# EAGLE design v1 (EAGLE 6.3)

## Sheet 1 of 2
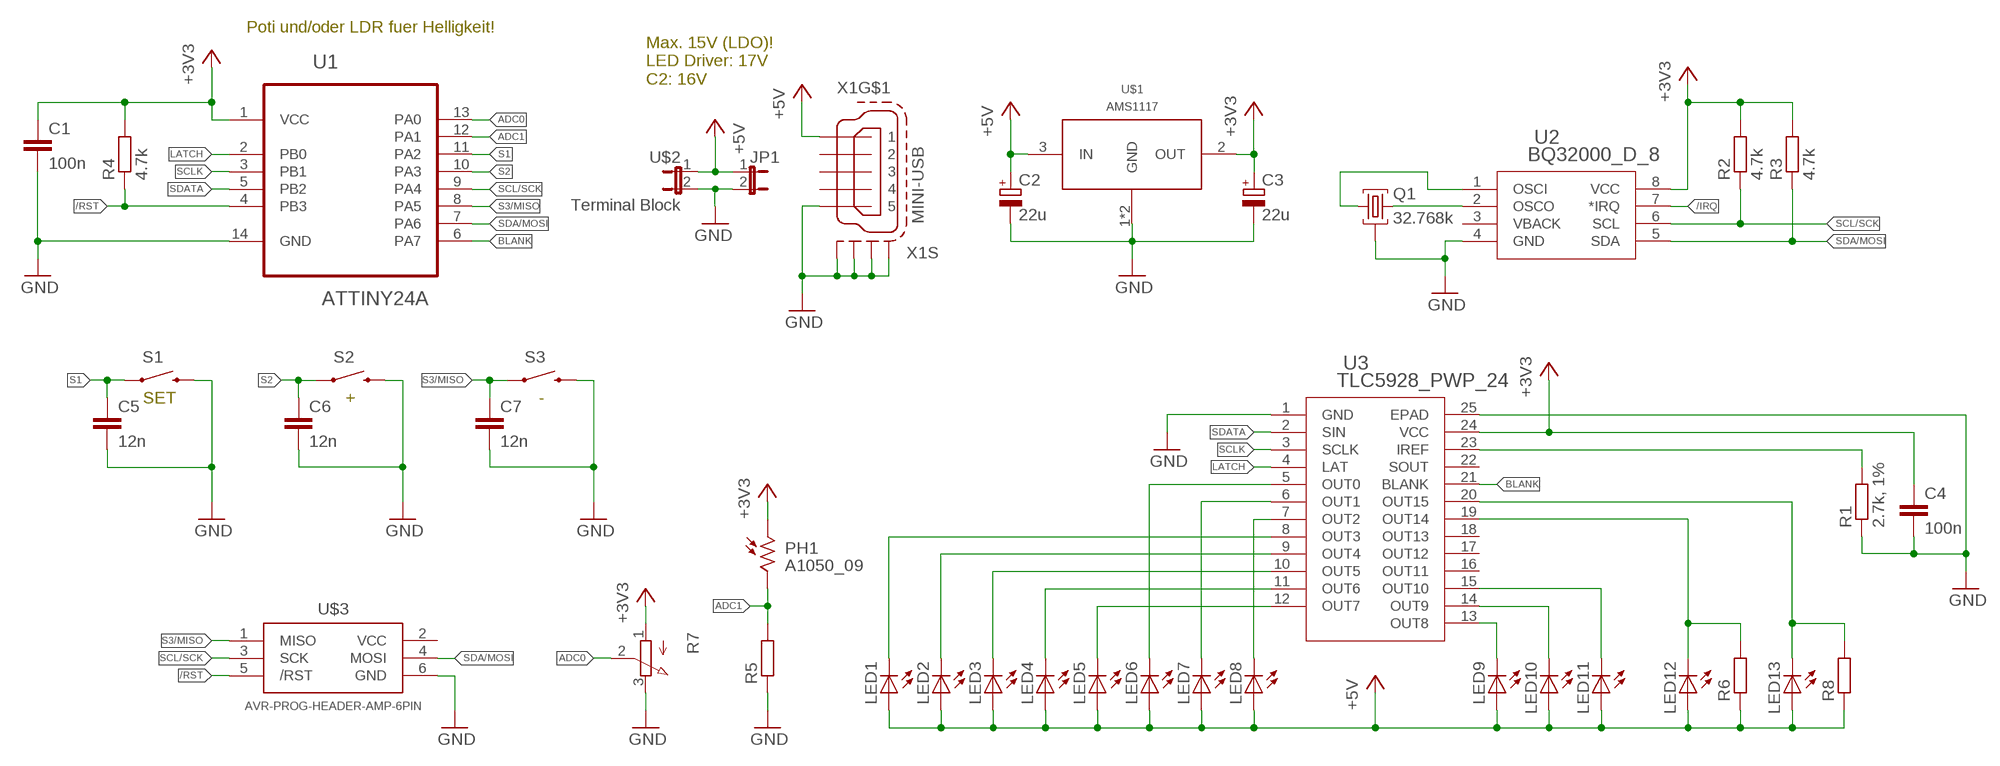
[diagram p0: schematic, sheet 1]

### Parts
C1  100n  C-EUC0603  [C0603]
C2  22u  CPOL-EU153CLV-0505  [153CLV-0505]
C3  22u  CPOL-EU153CLV-0505  [153CLV-0505]
C4  100n  C-EUC0603  [C0603]
C5  12n  C-EUC0603  [C0603]
C6  12n  C-EUC0603  [C0603]
C7  12n  C-EUC0603  [C0603]
JP1  JP1E  [JP1]
LED1  LEDCHIP-LED0603  [CHIP-LED0603]
LED2  LEDCHIP-LED0603  [CHIP-LED0603]
LED3  LEDCHIP-LED0603  [CHIP-LED0603]
LED4  LEDCHIP-LED0603  [CHIP-LED0603]
LED5  LEDCHIP-LED0603  [CHIP-LED0603]
LED6  LEDCHIP-LED0603  [CHIP-LED0603]
LED7  LEDCHIP-LED0603  [CHIP-LED0603]
LED8  LEDCHIP-LED0603  [CHIP-LED0603]
LED9  LEDCHIP-LED0603  [CHIP-LED0603]
LED10  LEDCHIP-LED0603  [CHIP-LED0603]
LED11  LEDCHIP-LED0603  [CHIP-LED0603]
LED12  LEDCHIP-LED0603  [CHIP-LED0603]
LED13  LEDCHIP-LED0603  [CHIP-LED0603]
PH1  A1050_09  [T0-46-A10XX]
Q1  32.768k  CRYSTAL_TC38_SHIELD  [TC38]
R1  2.7k, 1%  R-EU_R1206  [R1206]
R2  4.7k  R-EU_R0603  [R0603]
R3  4.7k  R-EU_R0603  [R0603]
R4  4.7k  R-EU_R0603  [R0603]
R5  R-EU_R0603  [R0603]
R6  R-EU_R0603  [R0603]
R7  3RP/1610N  [3RP/1610N]
R8  R-EU_R0603  [R0603]
S1  SWITCH-MOMENTARY-2PTH  [TACTILE-PTH]
S2  SWITCH-MOMENTARY-2PTH  [TACTILE-PTH]
S3  SWITCH-MOMENTARY-2PTH  [TACTILE-PTH]
U1  ATTINY24A  ATTINY24A-SSU  [SOIC127P600X175-14N]
U2  BQ32000_D_8  [D8]
U3  TLC5928_PWP_24  [PWP24_4P87X2P4]
U$1  AMS1117  [DCY4]
U$2  Terminal Block  BASTLI_SCREW_TERMINAL_SMALL  [BASTLI_SCREW_TERMINAL_SMALL]
U$3  AVR-PROG-HEADER-AMP-6PIN  [AMP-TMM-1-0-06]
X1  MINI-USB  MINI-USB-SCHIELD-32005-201  [32005-201]

### Nets
+3V3: C1.1 C3.+ C4.1 PH1.1 R2.2 R3.2 R4.2 R7.1(A) U1.1(VCC) U2.8(VCC) U3.24(VCC) U$1.2(OUT)
+5V: C2.+ JP1.1 LED1.A LED2.A LED3.A LED4.A LED5.A LED6.A LED7.A LED8.A LED9.A LED10.A LED11.A LED12.A LED13.A R6.1 R8.1 U$1.3(IN) U$2.1 X1.1
/IRQ: U2.7(*IRQ)
/RST: R4.1 U1.4(PB3) U$3.5(/RST)
ADC0: R7.2(S) U1.13(PA0)
ADC1: PH1.2 R5.2 U1.12(PA1)
BLANK: U1.6(PA7) U3.21(BLANK)
GND: C1.2 C2.- C3.- C4.2 C5.2 C6.2 C7.2 JP1.2 Q1.1 R1.1 R5.1 R7.3(E) S1.3 S2.3 S3.3 U1.14(GND) U2.4(GND) U3.1(GND) U3.25(EPAD) U$1.1(GND) U$1.4(GND) U$2.2 U$3.6(GND) X1.5 X1.M1(S:S1) X1.M2(S:S2) X1.M3(S:S3) X1.M4(S:S4) ; also sheet 2
LATCH: U1.2(PB0) U3.4(LAT)
N$1: LED1.C U3.8(OUT3)
N$2: LED2.C U3.9(OUT4)
N$3: LED3.C U3.10(OUT5)
N$4: LED4.C U3.11(OUT6)
N$5: LED5.C U3.12(OUT7)
N$6: R1.2 U3.23(IREF)
N$7: LED6.C U3.5(OUT0)
N$8: LED7.C U3.6(OUT1)
N$9: LED8.C U3.7(OUT2)
N$10: LED9.C U3.13(OUT8)
N$11: LED10.C U3.14(OUT9)
N$12: LED11.C U3.15(OUT10)
N$16: LED12.C R6.2 U3.19(OUT14)
N$17: LED13.C R8.2 U3.20(OUT15)
N$18: Q1.3 U2.2(OSCO)
N$19: Q1.2 U2.1(OSCI)
S1: C5.1 S1.1 U1.11(PA2)
S2: C6.1 S2.1 U1.10(PA3)
S3/MISO: C7.1 S3.1 U1.8(PA5) U$3.1(MISO)
SCL/SCK: R2.1 U1.9(PA4) U2.6(SCL) U$3.3(SCK)
SCLK: U1.3(PB1) U3.3(SCLK)
SDA/MOSI: R3.1 U1.7(PA6) U2.5(SDA) U$3.4(MOSI)
SDATA: U1.5(PB2) U3.2(SIN)
Unconnected: U3.16(OUT11) U3.17(OUT12) U3.18(OUT13) U3.22(SOUT) U$3.2(VCC) X1.2 X1.3 X1.4

### Notes on the sheet
- Poti und/oder LDR fuer Helligkeit!
- Max. 15V (LDO)!
  LED Driver: 17V
  C2: 16V
- SET | + | -

## Sheet 2 of 2
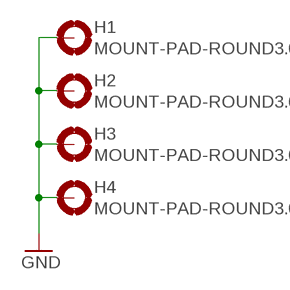
[diagram p1: schematic, sheet 2]

### Parts
H1  MOUNT-PAD-ROUND3.0  [3,0-PAD]
H2  MOUNT-PAD-ROUND3.0  [3,0-PAD]
H3  MOUNT-PAD-ROUND3.0  [3,0-PAD]
H4  MOUNT-PAD-ROUND3.0  [3,0-PAD]

### Nets
GND: H1.B3,0(MOUNT) H2.B3,0(MOUNT) H3.B3,0(MOUNT) H4.B3,0(MOUNT) ; also sheet 1

## Power pins joined to a net without a drawn wire
VBACK: U2.3(VBACK)

## Library data of the parts
C1 C4-C7 = rcl:C-EU: CAPACITOR, European symbol
C2 C3 = rcl:CPOL-EU: POLARIZED CAPACITOR, European symbol
H1-H4 = holes:MOUNT-PAD-ROUND: MOUNTING PAD, round
JP1 = jumper:JP1E: JUMPER
LED1-LED13 = led:LED: LED OSRAM: - CHIPLED LG R971, LG N971, LY N971, LG Q971, LY Q971, LO R971, LY R971 LH N974, LH R974 LS Q976, LO Q976, LY Q976 LO Q996 - Hyper CHIPLED LW Q18S LB Q993, LB Q99A, LB R99A - SideLED LS A670, LO A670, LY A670, LG A670, LP A670 LB A673, LV A673, LT A673, LW A673 LH A674 LY A675 LS A676, LA A676, LO A676, LY A676, LW A676 LS A679, LY A679, LG A679 - Hyper Micro SIDELED® LS Y876, LA Y876, LO Y876, LY Y876 LT Y87S - SmartLED LW L88C, LW L88S LB L89C, LB L89S, LG L890 LS L89K, LO L89K, LY L89K LS L896, LA L896, LO L896, LY L896 - TOPLED LS T670, LO T670, LY T670, LG T670, LP T670 LSG T670, LSP T670, LSY T670, LOP T670, LYG T670 LG T671, LOG T671, LSG T671 LB T673, LV T673, LT T673, LW T673 LH T674 LS T676, LA T676, LO T676, LY T676, LB T676, LH T676, LSB T676, LW T676 LB T67C, LV T67C, LT T67C, LS T67K, LO T67K, LY T67K, LW E67C LS E67B, LA E67B, LO E67B, LY E67B, LB E67C, LV E67C, LT E67C LW T67C LS T679, LY T679, LG T679 LS T770, LO T770, LY T770, LG T770, LP T770 LB T773, LV T773, LT T773, LW T773 LH T774 LS E675, LA E675, LY E675, LS T675 LS T776, LA T776, LO T776, LY T776, LB T776 LHGB T686 LT T68C, LB T68C - Hyper Mini TOPLED® LB M676 - Mini TOPLED Santana® LG M470 LS M47K, LO M47K, LY M47K Source: http://www.osram.convergy.de LUXEON: - LUMILED® LXK2-PW12-R00, LXK2-PW12-S00, LXK2-PW14-U00, LXK2-PW14-V00 LXK2-PM12-R00, LXK2-PM12-S00, LXK2-PM14-U00 LXK2-PE12-Q00, LXK2-PE12-R00, LXK2-PE12-S00, LXK2-PE14-T00, LXK2-PE14-U00 LXK2-PB12-K00, LXK2-PB12-L00, LXK2-PB12-M00, LXK2-PB14-N00, LXK2-PB14-P00, LXK2-PB14-Q00 LXK2-PR12-L00, LXK2-PR12-M00, LXK2-PR14-Q00, LXK2-PR14-R00 LXK2-PD12-Q00, LXK2-PD12-R00, LXK2-PD12-S00 LXK2-PH12-R00, LXK2-PH12-S00 LXK2-PL12-P00, LXK2-PL12-Q00, LXK2-PL12-R00 Source: www.luxeon.com KINGBRIGHT: KA-3528ASYC Source: www.kingbright.com
PH1 = photo-elements:A10: Sensor Robust Light Sensing Applications Outdoor Light Sensing Application Source: http://optoelectronics.perkinelmer.com/content/Datasheets/DTS_PhotocellsA1050.pdf
Q1 = Parts:CRYSTAL_TC38_SHIELD
R1-R6 R8 = rcl:R-EU_: RESISTOR, European symbol
R7 = pot:3RP/1610N: 16mm Potentiometer one level Source: http://www.alphapotentiometers.net/html/16mm_pot_2.html
S1-S3 = SparkFun-Electromechanical:SWITCH-MOMENTARY-2: Various NO switches- pushbuttons, reed, etc
U1 = Farnell:ATTINY24A-SSU: 8-bit Microcontroller with In-System Programmable Flash; MPN: ATTINY24A-SSU; OC_FARNELL: 1699395; OC_NEWARK: 80P3681; PACKAGE: SOIC-14; SUPPLIER: Atmel
U2 = Parts:BQ32000_D_8; DATASHEETURL: http://www.ti.com/lit/gpn/BQ32000; DESCRIPTION: Serial RTC with Battery Backup and Trickle Charge; FAMILY_NAME: REAL-TIME CLOCK; GENERIC_PART_NUMBER: BQ32000; INDUSTRY_STD_PKG_TYPE: SOIC; MANUFACTURER: Texas Instruments; PACKAGE_DESIGNATOR: D; PIN_COUNT: 8
U3 = Parts:TLC5928_PWP_24; DATASHEETURL: http://www.ti.com/lit/gpn/TLC5928; DESCRIPTION: 16 Channel Constant Current LED Driver with LED Open Detection; FAMILY_NAME: LED DRIVER; GENERIC_PART_NUMBER: TLC5928; INDUSTRY_STD_PKG_TYPE: HTSSOP; MANUFACTURER: Texas Instruments; MANUFACTURER_PART_NUMBER: tlc5928_pwp_24; PACKAGE_DESIGNATOR: PWP; PIN_COUNT: 24; VENDOR: Texas Instruments
U$1 = Parts:AMS1117: AMS1117 1A low dropout voltage regulator 1V max dropout SOT-223
U$2 = Parts:BASTLI_SCREW_TERMINAL_SMALL
U$3 = Parts:AVR-PROG-HEADER-AMP-6PIN
X1 = con-cypressindustries:MINI-USB-SCHIELD-: MINI USB-B Conector Source: www.cypressindustries.com; OC_FARNELL: unknown; OC_NEWARK: unknown

## Board
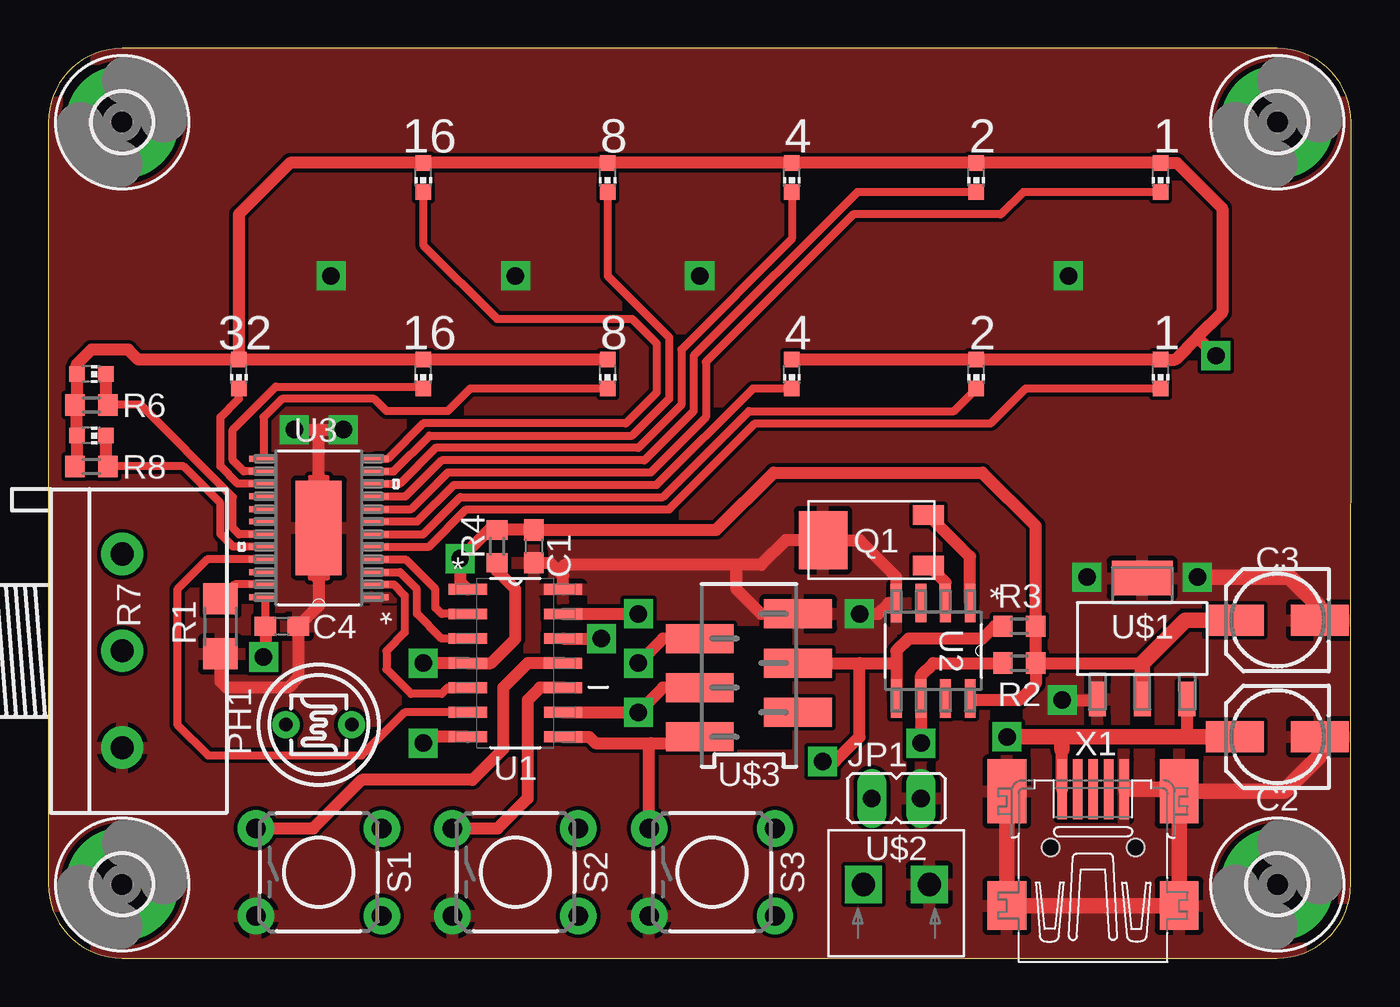
[diagram p2: board, top side]
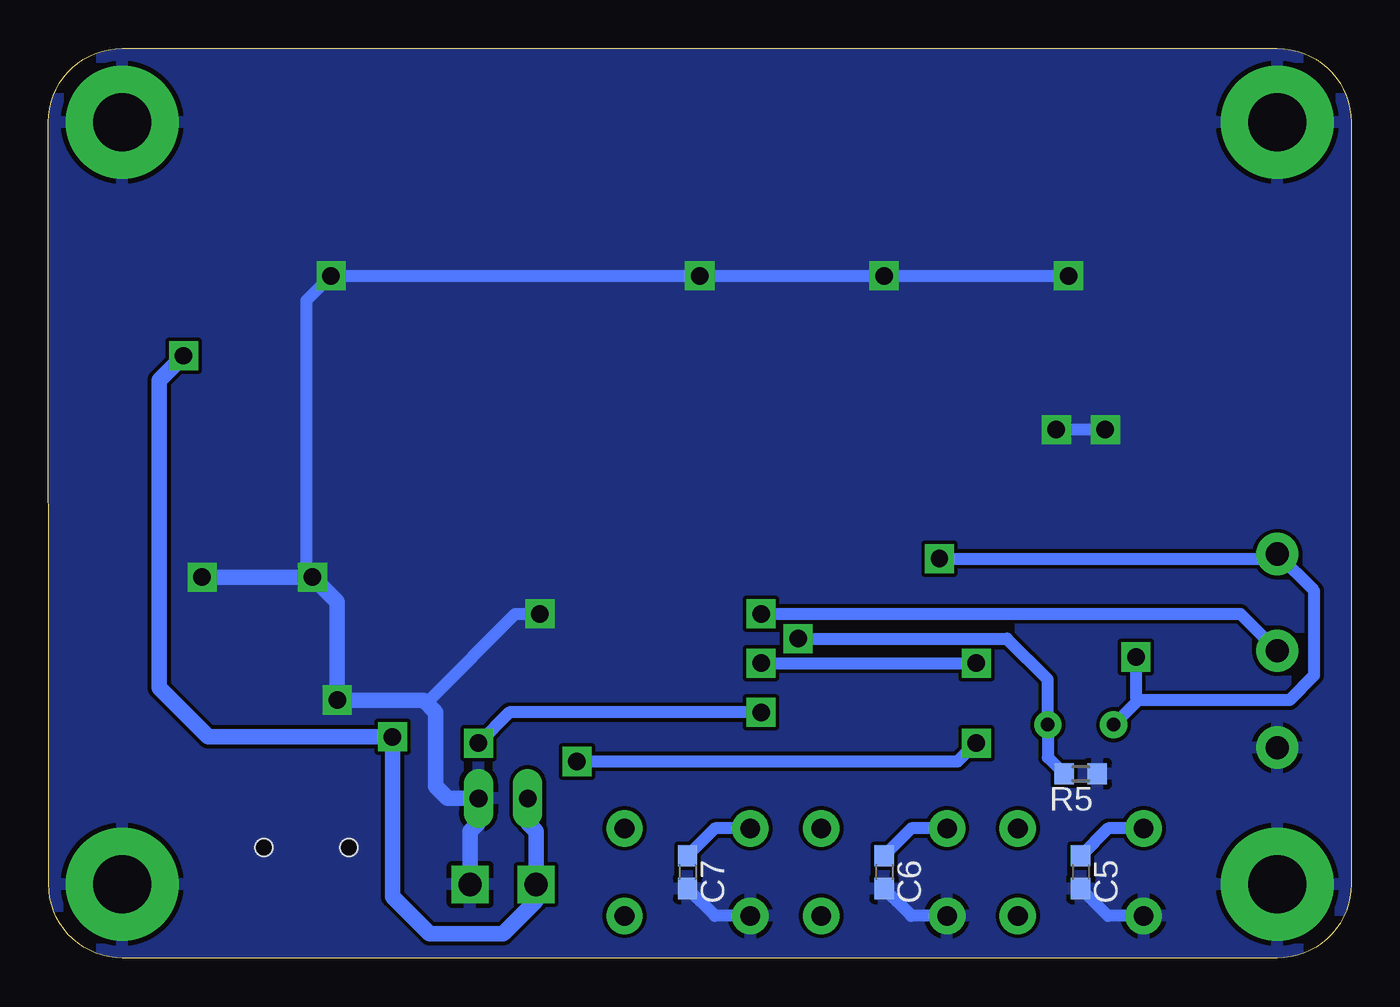
[diagram p3: board, bottom side, seen from below]

Size 67.31 x 46.99 mm. Coordinates in mm from the lower left corner, seen from the top.
Outline: 0,43.18 0,3.81 arc90 3.81,0 63.48,0 arc90 67.29,3.81 67.31,43.18 arc90 63.5,46.99 3.81,46.99 arc90 0,43.18
Copper layers (1*16): Top 0.035mm / dielectric 1.5mm / Bottom 0.035mm
Design rules "bastli-pcb *": minimum track width 0.2mm, minimum drill 0.4mm, track to track 0.2mm, track to pad 0.2mm, pad to pad 0.2mm, via to via 0.2mm, smd to smd 0.2mm, copper to edge 1mil, drill to drill 8mil, minimum pad ring 0.3mm, minimum via ring 0.3mm, stop-mask expansion 4mil, vias tented up to drill 0mil, thermal gap 10mil
tRestrict: area 34,10.8 to 38.4,17.1

### Footprints (pad centres in the part's own frame; a part is rotated, then mirrored left to right if it is on the bottom)
C0603 = smd 1.1 x 1: 1 -0.85,0; 2 0.85,0
153CLV-0505 = smd 3 x 1.6: + 2.2,0; - -2.2,0
3,0-PAD = drill 3 pad 5.842: B3,0 0,0
JP1 = drill 0.914 long: 1 0,-1.27; 2 0,1.27
CHIP-LED0603 = smd 0.8 x 0.8: A 0,-0.75; C 0,0.75
T0-46-A10XX = drill 0.7 pad 1.4: 1 -1.7,0; 2 1.7,0
TC38 = smd 2.5 x 3: 1 -1.25,0 | smd 1.6 x 1: 2 4.2,1.3; 3 4.2,-1.3
R1206 = smd 1.6 x 1.803: 1 -1.422,0; 2 1.422,0
R0603 = smd 1 x 1.1: 1 -0.85,0; 2 0.85,0
3RP/1610N = drill 1.2 pad 2.184: 1 -5,0; 2 0,0; 3 5,0
TACTILE-PTH = drill 1.016 pad 1.88: 1 -3.251,2.261; 2 3.251,2.261; 3 -3.251,-2.261; 4 3.251,-2.261
SOIC127P600X175-14N = smd 1.981 x 0.559: 1 -2.464,3.81; 2 -2.464,2.54; 3 -2.464,1.27; 4 -2.464,0; 5 -2.464,-1.27; 6 -2.464,-2.54; 7 -2.464,-3.81; 8 2.464,-3.81; 9 2.464,-2.54; 10 2.464,-1.27; 11 2.464,0; 12 2.464,1.27; 13 2.464,2.54; 14 2.464,3.81
D8 = smd 1.981 x 0.559: 1 -2.464,1.905; 2 -2.464,0.635; 3 -2.464,-0.635; 4 -2.464,-1.905; 5 2.464,-1.905; 6 2.464,-0.635; 7 2.464,0.635; 8 2.464,1.905
PWP24_4P87X2P4 = smd 1.27 x 0.305: 1 -2.972,3.581; 2 -2.972,2.921; 3 -2.972,2.286; 4 -2.972,1.626; 5 -2.972,0.965; 6 -2.972,0.33; 7 -2.972,-0.33; 8 -2.972,-0.965; 9 -2.972,-1.626; 10 -2.972,-2.286; 11 -2.972,-2.921; 12 -2.972,-3.581; 13 2.972,-3.581; 14 2.972,-2.921; 15 2.972,-2.286; 16 2.972,-1.626; 17 2.972,-0.965; 18 2.972,-0.33; 19 2.972,0.33; 20 2.972,0.965; 21 2.972,1.626; 22 2.972,2.286; 23 2.972,2.921; 24 2.972,3.581 | smd 2.388 x 4.877: 25 0,0
DCY4 = smd 0.889 x 1.778: 1 -2.311,-3.124; 2 0,-3.124; 3 2.311,-3.124 | smd 3.15 x 1.778: 4 0,3.124
BASTLI_SCREW_TERMINAL_SMALL = drill 1.2 square: 1 -1.7,0; 2 1.7,0
AMP-TMM-1-0-06 = smd 1.5 x 3.5: 1 3.175,-2.54; 2 1.905,2.54; 3 0.635,-2.54; 4 -0.635,2.54; 5 -1.905,-2.54; 6 -3.175,2.54
32005-201 = smd 3.1 x 0.5: 1 3,1.6; 2 3,0.8; 3 3,0; 4 3,-0.8; 5 3,-1.6 | smd 2.5 x 2: M1 -3,-4.45; M2 -3,4.45 | smd 3.3 x 2: M3 2.9,4.45; M4 2.9,-4.45 | hole 0.9: 0,2.2; 0,-2.2

### Placement (x,y rotation side)
C1  25.08,21.27 270 top
C2  63.5,11.43 180 top
C3  63.5,17.46 180 top
C4  12.06,17.14 0 top
C5  13.97,4.45 270 bottom
C6  24.13,4.45 270 bottom
C7  34.29,4.45 270 bottom
H1  63.5,43.18 0 top
H2  3.81,43.18 0 top
H3  3.81,3.81 0 top
H4  63.5,3.81 0 top
JP1  43.81,8.26 270 top
LED1  57.47,40.32 180 top
LED2  47.94,40.32 180 top
LED3  38.42,40.32 180 top
LED4  28.89,40.32 180 top
LED5  19.37,40.32 180 top
LED6  57.47,30.16 180 top
LED7  47.94,30.16 180 top
LED8  38.42,30.16 180 top
LED9  28.89,30.16 180 top
LED10  19.37,30.16 180 top
LED11  9.84,30.16 180 top
LED12  2.22,30.16 270 top
LED13  2.22,26.99 270 top
PH1  13.97,12.06 0 top
Q1  41.27,21.59 0 top
R1  8.89,17.14 90 top
R2  50.16,15.24 0 top
R3  50.16,17.14 0 top
R4  23.18,21.27 90 top
R5  13.97,9.53 180 bottom
R6  2.22,28.57 0 top
R7  3.81,15.88 270 top
R8  2.22,25.4 0 top
S1  13.97,4.45 0 top
S2  24.13,4.45 0 top
S3  34.29,4.45 0 top
U1  24.13,15.24 0 top
U2  45.72,15.88 270 top
U3  13.97,22.23 180 top
U$1  56.52,16.51 0 top
U$2  43.81,3.81 0 top
U$3  36.2,14.61 270 top
X1  53.98,5.71 90 top

### Tracks (layer width: path | path; a pad name or v marks a point on that pad's centre or on a via)
+3V3  (via drill 0.9)
  Top 0.406: C4.1 11.21,18.43 U3.24
  Top 0.61: R2.2 51.02,14.19 50.16,13.34 47.7,13.34 U2.8 | R2.2 R3.2 51.02,22.33 48.26,25.08 37.47,25.08 34.51,22.12 C1.1 R4.2 22.76,22.12 v21.27,20.64 21.27,19.44 U1.1 | R2.2 56.52,15.24 | C4.1 11.21,15.66 v11.11,15.56
  Top 0.813: U$1.2 56.52,15.24 58.74,17.46 C3.+
  Bottom 0.61: 11,13.34 3.17,13.34 1.91,14.61 1.91,18.97 R7.1 4.05,20.64 v21.27,20.64 | 11,13.34 PH1.1 | v11.11,15.56 11.11,13.45 11,13.34
+5V  (via drill 0.9)
  Top 0.61: X1.1 52.38,10.78 | U$1.3 58.83,11.66 59.05,11.43 | LED8.A LED7.A LED6.A 58.22,30.91 59.37,32.07 | LED9.A LED10.A LED11.A | LED11.A 9.84,38.42 12.5,41.07 LED5.A LED4.A LED3.A LED2.A LED1.A 58.3,41.07 60.64,38.73 60.64,33.34 59.37,32.07 | 59.37,32.07 v60.33,31.11 | R8.1 1.47,25.5 LED13.A 1.47,28.48 R6.1 1.47,28.68 LED12.A 1.47,30.68 2.22,31.43 4.13,31.43 4.65,30.91 LED11.A
  Top 0.813: 52.38,10.78 52.38,11.43 | 52.38,11.43 59.05,11.43 C2.+ | 52.38,11.43 v49.53,11.43
  Bottom 0.813: JP1.1 42.55,6.99 42.12,6.55 U$2.1 42.12,2.97 43.81,1.27 47.62,1.27 49.53,3.17 v49.53,11.43 59.05,11.43 61.59,13.97 61.59,29.84 v60.33,31.11
/RST  (via drill 0.9)
  Top 0.61: U$3.5 31.75,16.51 v30.48,15.24 | v19.37,15.24 U1.4 22.86,15.24 24.13,16.51 24.13,19.05 23.18,20 R4.1
  Bottom 0.61: v30.48,15.24 v19.37,15.24
ADC0  (via drill 0.9)
  Top 0.61: U1.13 v30.48,17.78
  Bottom 0.61: v30.48,17.78 5.71,17.78 R7.2
ADC1  (via drill 0.9)
  Top 0.61: U1.12 v28.57,16.51
  Bottom 0.61: v28.57,16.51 17.78,16.51 15.67,14.4 PH1.2 15.67,10.38 R5.2
BLANK
  Top 0.406: U3.21 8.22,20.6 6.67,19.05 6.67,12.06 8.26,10.48 16.19,10.48 18.41,12.7 U1.6
GND  (via drill 0.9)
  Top 0.61: 35.56,20.32 36.83,20.32 38.1,21.59 Q1.1 41.91,21.59 43.81,19.68 U2.4 43.42,18.34 42.86,17.78 v41.91,17.78 | 35.56,20.32 26.67,20.32 26.35,20 | U$3.6 36.83,17.78 35.56,19.05 35.56,20.32 | X1.5 55.7,8.71 | v12.7,27.3 13.97,27.3 | 13.97,27.3 v15.24,27.3 | 13.97,24.77 13.97,27.3 | v52.39,13.34 54.15,13.34 U$1.1 | U1.14 26.59,19.76 26.35,20 | C1.2 25.93,20.42 26.35,20 | 13.97,19.68 13.97,18.2 C4.2 12.91,14.5 12.38,13.97 9.21,13.97 8.89,14.29 R1.1
  Top 0.813: v59.37,19.68 64.14,19.68 65.7,18.12 C3.- | 55.7,8.71 58.33,8.71 X1.M4 | X1.M4 63.86,8.62 65.7,10.46 C2.- | X1.M3 X1.M2 X1.M1 X1.M4 | 13.97,24.77 U3.25 13.97,19.68
  Bottom 0.61: S1.3 12.56,2.18 C5.2 | S2.3 22.72,2.18 C6.2 | S3.3 32.88,2.18 C7.2 | v12.7,27.3 v15.24,27.3 | 47.62,13.02 47.62,13.34 43.18,17.78 v41.91,17.78 | v14.61,35.24 v24.13,35.24 v33.66,35.24 v52.7,35.24 53.98,33.97 53.98,19.68
  Bottom 0.813: U$2.2 45.52,6.55 45.09,6.99 JP1.2 46.67,8.26 47.31,8.89 47.31,12.7 47.62,13.02 47.94,13.34 v52.39,13.34 52.39,18.41 v53.66,19.68 53.98,19.68 v59.37,19.68
  pour Top: 0,46.99 67.31,46.99 67.31,0 0,0
  pour Bottom: 0,46.99 67.31,46.99 67.31,0 0,0
LATCH
  Top 0.406: U3.4 18.45,20.6 20,19.05 20,18.1 20.32,17.78 U1.2
N$1
  Top 0.406: LED1.C 50.37,39.57 49.21,38.42 41.59,38.42 33.97,30.8 33.97,27.94 31.11,25.08 20.64,25.08 18.75,23.19 U3.8
N$2
  Top 0.406: LED2.C 41.8,39.57 33.34,31.11 33.34,28.26 30.8,25.72 20.32,25.72 18.45,23.85 U3.9
N$3
  Top 0.406: U3.10 18.16,24.51 20,26.35 30.48,26.35 32.7,28.57 32.7,31.43 38.42,37.15 LED3.C
N$4
  Top 0.406: LED4.C 28.89,35.24 32.07,32.07 32.07,28.89 30.16,26.99 19.68,26.99 17.84,25.15 U3.11
N$5
  Top 0.406: LED5.C 19.37,36.83 23.18,33.02 30.16,33.02 31.43,31.75 31.43,29.21 29.84,27.62 19.37,27.62 17.55,25.81 U3.12
N$6
  Top 0.406: U3.23 9.63,19.3 R1.2
N$7
  Top 0.406: U3.5 19.67,21.26 21.59,23.18 32.07,23.18 36.51,27.62 48.69,27.62 50.48,29.41 LED6.C
N$8
  Top 0.406: U3.6 19.36,21.89 21.27,23.81 31.75,23.81 36.2,28.26 46.79,28.26 LED7.C
N$9
  Top 0.406: U3.7 19.06,22.55 20.95,24.45 31.43,24.45 36.4,29.41 LED8.C
N$10
  Top 0.406: LED9.C 21.79,29.41 20.64,28.26 17.46,28.26 16.83,28.89 12.06,28.89 11.11,27.94 11.11,25.92 U3.13
N$11
  Top 0.406: U3.14 10.1,25.15 9.53,25.72 9.53,27.3 11.75,29.53 19.25,29.53 LED10.C
N$12
  Top 0.406: U3.15 9.78,24.51 8.89,25.4 8.89,27.94 9.84,28.89 LED11.C
N$16
  Top 0.406: U3.19 9.86,21.89 9.53,22.23 9.53,23.81 4.76,28.57 R6.2
  Top 0.61: LED12.C 2.97,28.68 R6.2
N$17
  Top 0.406: U3.20 9.54,21.26 8.89,21.91 8.89,23.5 6.99,25.4 R8.2
  Top 0.61: LED13.C 2.97,25.5 R8.2
N$18
  Top 0.61: U2.2 46.35,19.41 Q1.3
N$19
  Top 0.61: U2.1 47.62,20.74 Q1.2
S1
  Top 0.61: U1.11 24.77,15.24 23.5,13.97 23.5,10.79 21.91,9.21 16.19,9.21 13.69,6.71 S1.1
  Bottom 0.61: S1.1 12.56,6.71 C5.1
S2
  Top 0.61: U1.10 25.4,13.97 24.77,13.34 24.77,8.26 23.22,6.71 S2.1
  Bottom 0.61: S2.1 22.72,6.71 C6.1
S3/MISO
  Top 0.61: U1.8 27.94,11.43 28.26,11.11 31.11,11.11 | 31.11,11.11 33.34,11.11 U$3.1 | S3.1 31.04,11.04 31.11,11.11
  Bottom 0.61: S3.1 32.88,6.71 C7.1
SCL/SCK  (via drill 0.9)
  Top 0.61: U1.9 v30.48,12.7 31.75,13.97 U$3.3 | R2.1 45.72,15.24 45.09,14.61 U2.6 v45.09,11.11
  Bottom 0.61: v30.48,12.7 43.5,12.7 v45.09,11.11
SCLK
  Top 0.406: U3.3 18.16,19.94 19.05,19.05 19.05,17.78 20.32,16.51 U1.3
SDA/MOSI  (via drill 0.9)
  Top 0.61: 43.81,15.24 43.81,15.88 44.45,16.51 48.26,16.51 48.9,17.14 R3.1 | 43.81,15.24 U2.5 | U$3.4 41.91,15.24 | 41.91,15.24 41.91,11.43 40.64,10.16 v40.01,10.16 | 41.91,15.24 43.81,15.24 | U1.7 19.68,11.43 v19.37,11.11
  Bottom 0.61: v19.37,11.11 20.32,10.16 v40.01,10.16
SDATA
  Top 0.406: U1.5 20.64,13.97 20.32,13.65 18.73,13.65 17.46,14.92 17.46,15.88 18.41,16.83 18.41,18.73 17.84,19.3 U3.2

### Text on the board
tPlace: 16 | 8 | 4 | 2 | 1 | 32 | 16 | 8 | 4 | 2 | 1